# Altium schematic sheet communication.SchDoc
size A3; DocumentNumber: 2; SheetNumber: 2; SheetTotal: 45; SheetDescription: Communication
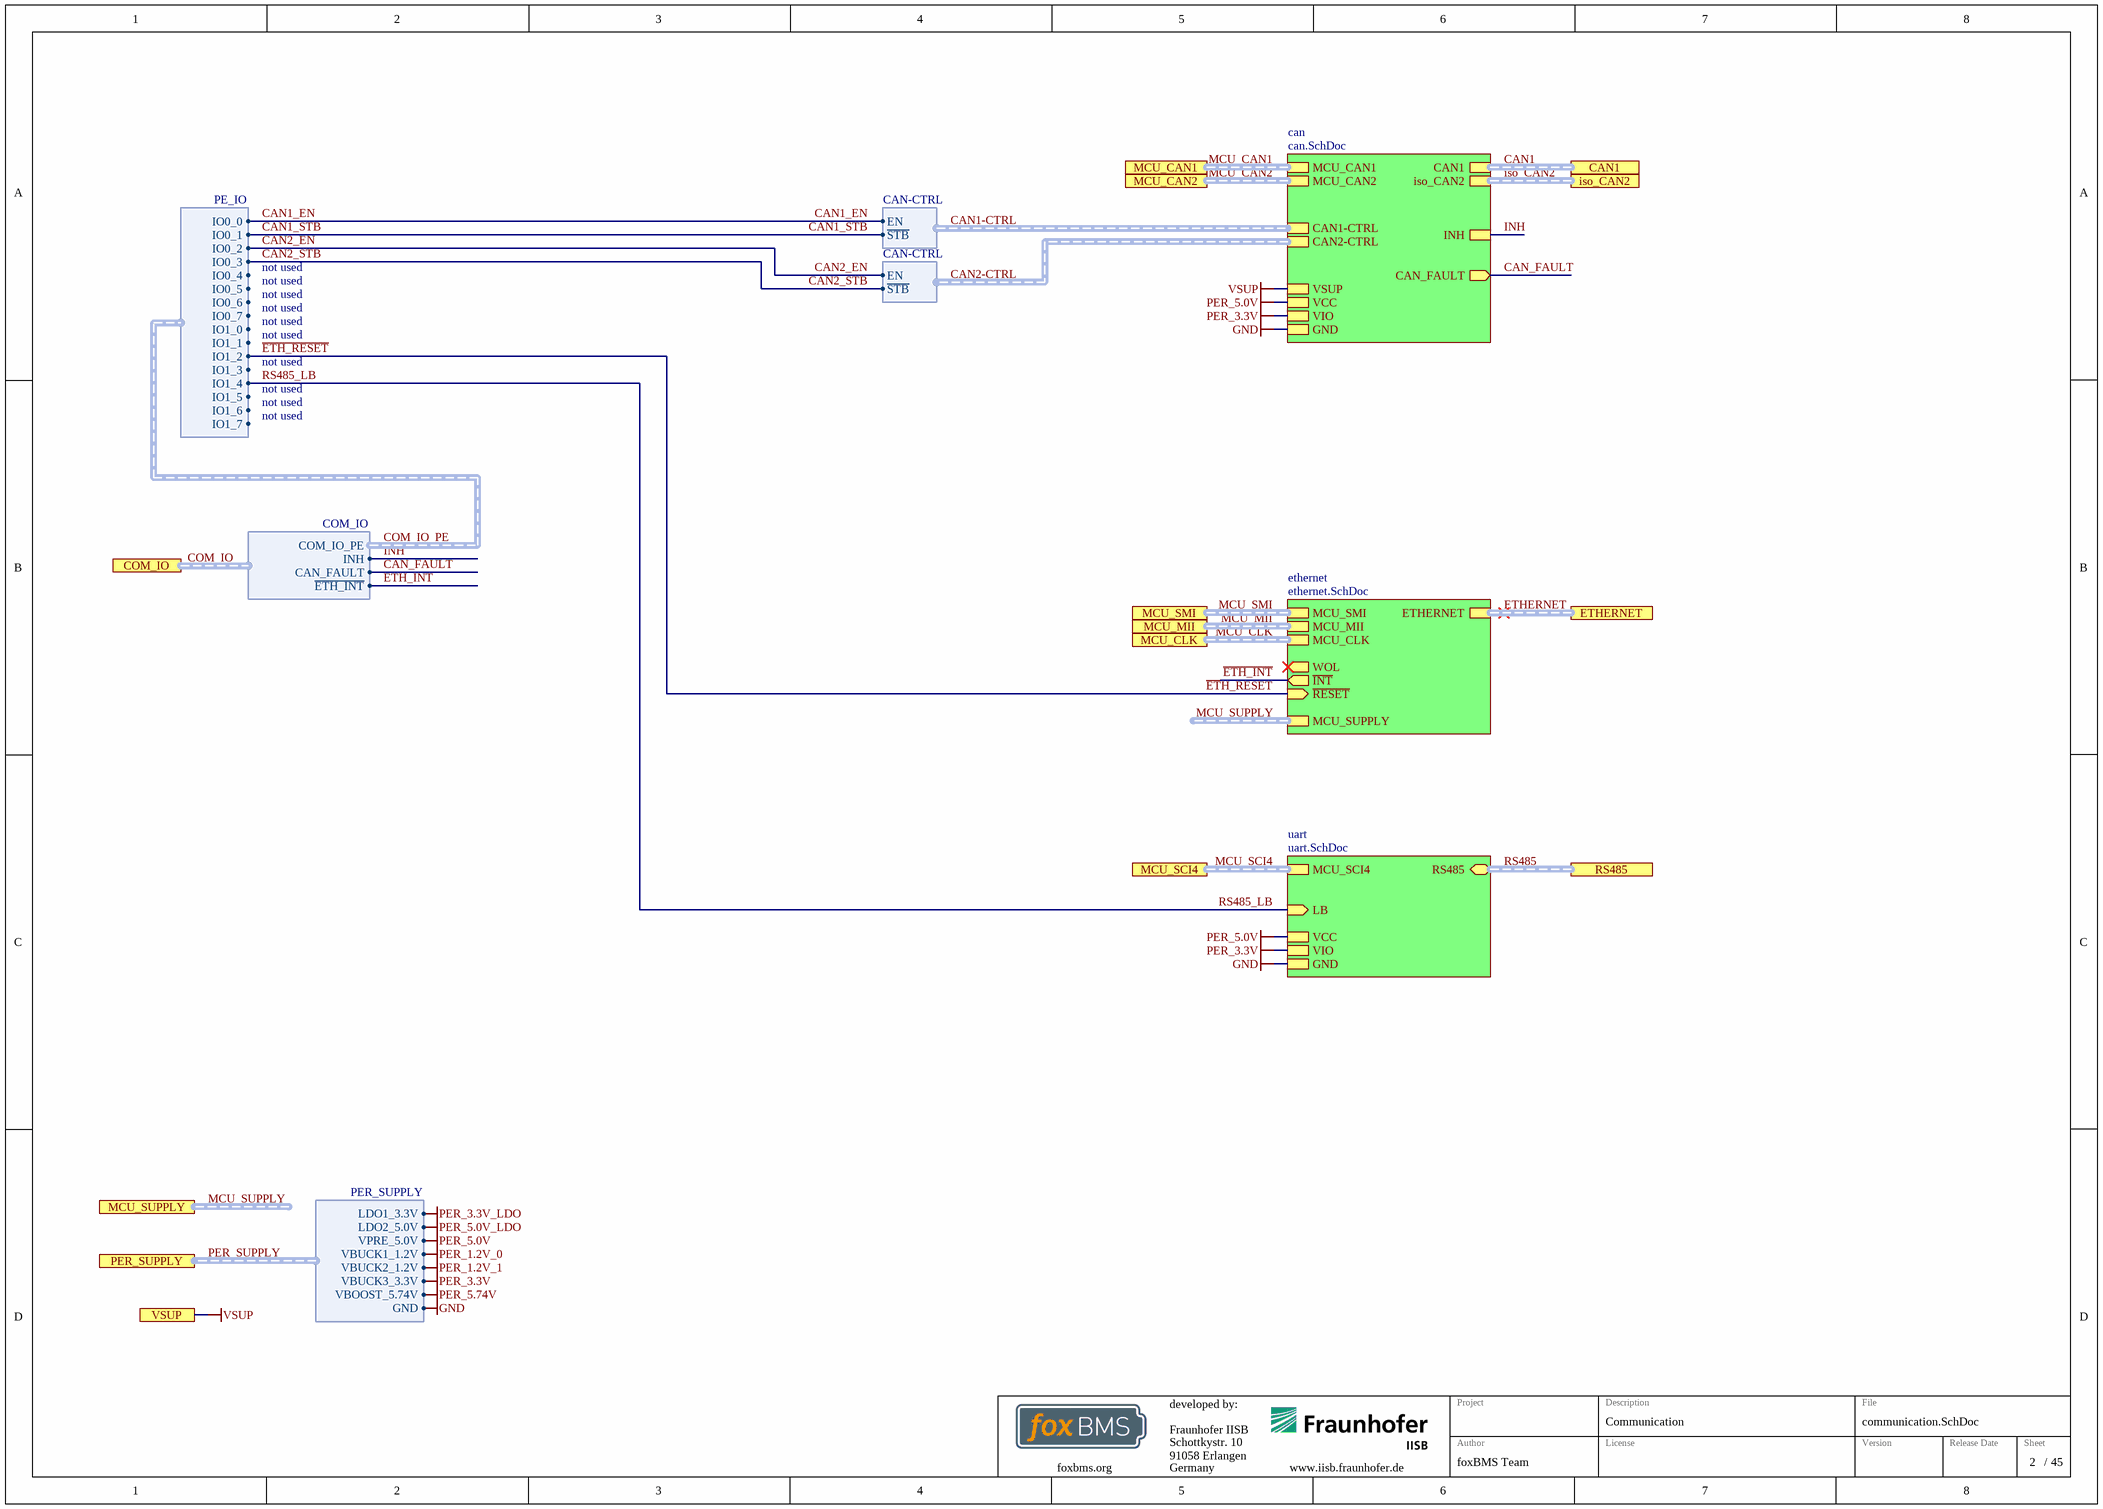
[diagram p0: communication.SchDoc]

## Sub-sheets
can = can.SchDoc: MCU_CAN1 (harness MCU_CAN), CAN2-CTRL (harness CAN-CTRL), CAN1-CTRL (harness CAN-CTRL), MCU_CAN2 (harness MCU_CAN), iso_CAN2 (harness CAN), CAN1 (harness CAN), VCC, GND, VSUP, INH, CAN_FAULT (out), VIO
ethernet = ethernet.SchDoc: MCU_SMI (harness MCU_SMI), WOL (out), MCU_MII (harness MCU_MII), ~{INT} (out), ~{RESET} (in), ETHERNET (harness ETHERNET), MCU_SUPPLY (harness MCU_SUPPLY), MCU_CLK (harness CLOCK)
uart = uart.SchDoc: MCU_SCI4 (harness MCU_SCI), LB (in), VIO, RS485 (bidir, harness RS485), VCC, GND

## Ports
CAN1 (harness CAN), COM_IO (harness COM_IO), ETHERNET (harness ETHERNET), iso_CAN2 (harness CAN), MCU_CAN1 (harness MCU_CAN), MCU_CAN2 (harness MCU_CAN), MCU_CLK (harness CLOCK), MCU_MII (harness MCU_MII), MCU_SCI4 (harness MCU_SCI), MCU_SMI (harness MCU_SMI), MCU_SUPPLY (harness MCU_SUPPLY), PER_SUPPLY (harness PER_SUPPLY), RS485 (harness RS485), VSUP

## Harnesses
PE_IO: IO0_0, IO0_1, IO0_2, IO0_3, IO0_4, IO0_5, IO0_6, IO0_7, IO1_0, IO1_1, IO1_2, IO1_3, IO1_4, IO1_5, IO1_6, IO1_7
CAN-CTRL: EN, ~{STB}
PER_SUPPLY: GND, VBOOST_5.74V, LDO1_3.3V, LDO2_5.0V, VPRE_5.0V, VBUCK1_1.2V, VBUCK2_1.2V, VBUCK3_3.3V
COM_IO: COM_IO_PE, CAN_FAULT, ~{ETH_INT}, INH

## Nets
GND: sheet can/GND, sheet uart/GND, port PER_SUPPLY.GND  [project net PER_SUPPLY.GND]
PER_1.2V_0: port PER_SUPPLY.VBUCK1_1.2V  [project net PER_SUPPLY.VBUCK1_1.2V]
PER_1.2V_1: port PER_SUPPLY.VBUCK2_1.2V  [project net PER_SUPPLY.VBUCK2_1.2V]
PER_3.3V: sheet can/VIO, sheet uart/VIO, port PER_SUPPLY.VBUCK3_3.3V  [project net PER_SUPPLY.VBUCK3_3.3V]
PER_3.3V_LDO: port PER_SUPPLY.LDO1_3.3V  [project net PER_SUPPLY.LDO1_3.3V]
PER_5.0V: sheet can/VCC, sheet uart/VCC, port PER_SUPPLY.VPRE_5.0V  [project net PER_SUPPLY.VPRE_5.0V]
PER_5.0V_LDO: port PER_SUPPLY.LDO2_5.0V  [project net PER_SUPPLY.LDO2_5.0V]
PER_5.74V: port PER_SUPPLY.VBOOST_5.74V  [project net PER_SUPPLY.VBOOST_5.74V]
VSUP: port VSUP, sheet can/VSUP
~{CAN1_STB}: harness PE_IO.IO0_1, sheet can/CAN1-CTRL.~{STB}
~{CAN2_STB}: harness PE_IO.IO0_3, sheet can/CAN2-CTRL.~{STB}
~{ETH_INT}: sheet ethernet/~{INT}, port COM_IO.~{ETH_INT}
~{ETH_RESET}: sheet ethernet/~{RESET}, harness PE_IO.IO1_2
CAN1_EN: harness PE_IO.IO0_0, sheet can/CAN1-CTRL.EN  [project net CAN1-CTRL.EN]
CAN2_EN: harness PE_IO.IO0_2, sheet can/CAN2-CTRL.EN  [project net CAN2-CTRL.EN]
CAN_FAULT: sheet can/CAN_FAULT, port COM_IO.CAN_FAULT
INH: sheet can/INH, port COM_IO.INH  [project net COM_IO.INH]
RS485_LB: sheet uart/LB, harness PE_IO.IO1_4  [project net COM_IO_PE.IO1_4]

## Buses and harness runs
harness CAN1 = port CAN1 = sheet can/CAN1
harness CAN1-CTRL = sheet can/CAN1-CTRL
harness CAN2-CTRL = sheet can/CAN2-CTRL
harness COM_IO = port COM_IO
harness ETHERNET = port ETHERNET = sheet ethernet/ETHERNET
harness iso_CAN2 = port iso_CAN2 = sheet can/iso_CAN2
harness MCU_CAN1 = port MCU_CAN1 = sheet can/MCU_CAN1
harness MCU_CAN2 = port MCU_CAN2 = sheet can/MCU_CAN2
harness MCU_CLK = port MCU_CLK = sheet ethernet/MCU_CLK
harness MCU_MII = port MCU_MII = sheet ethernet/MCU_MII
harness MCU_SCI4 = port MCU_SCI4 = sheet uart/MCU_SCI4
harness MCU_SMI = port MCU_SMI = sheet ethernet/MCU_SMI
harness MCU_SUPPLY = port MCU_SUPPLY
harness MCU_SUPPLY = sheet ethernet/MCU_SUPPLY
harness PER_SUPPLY = port PER_SUPPLY
harness RS485 = port RS485 = sheet uart/RS485

## Notes on the sheet
- not used
- Fraunhofer IISB
- Schottkystr. 10
- developed by:
- 91058 Erlangen
- Germany
- Author
- Project
- License
- Description
- File
- Version
- Release Date
- Sheet
- foxbms.org <https://foxbms.org>
- www.iisb.fraunhofer.de <https://www.iisb.fraunhofer.de/>
- foxBMS Team
- /